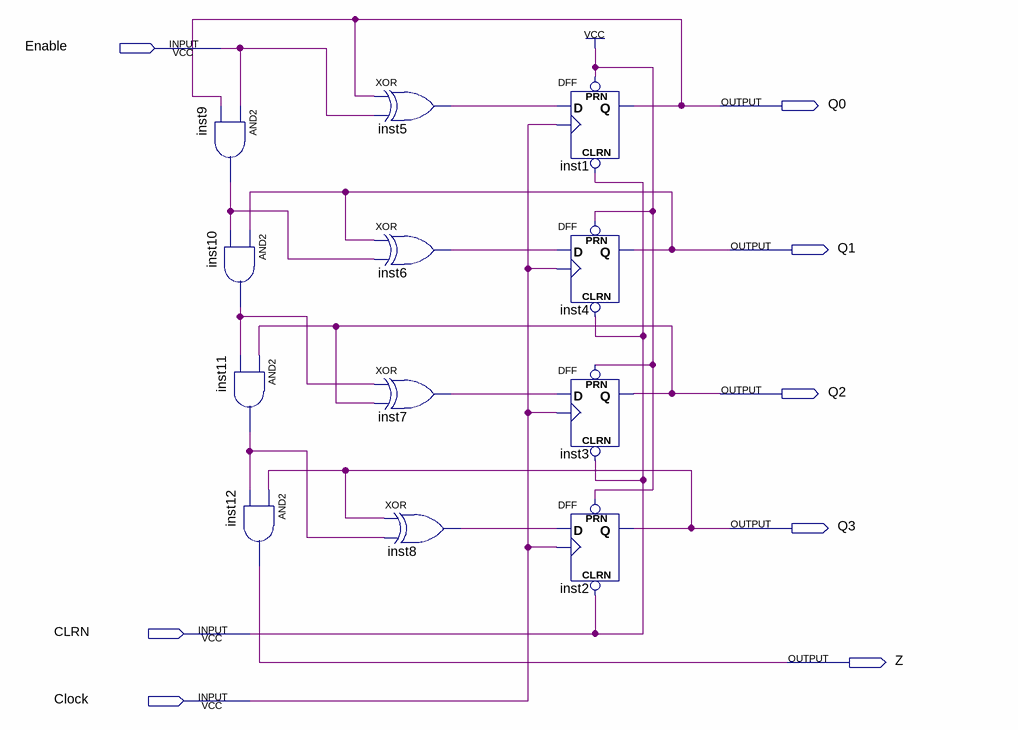
[diagram p0: schematic sheet]
// Quartus schematic lab10step2a.bdf as structural Verilog: 12 symbols, 8 pins
module lab10step2a (
  input  Enable,
  input  CLRN,
  input  Clock,
  output Q0,
  output Q1,
  output Q2,
  output Q3,
  output Z
);

  wire inst5_out, inst6_out, inst7_out, inst8_out, inst9_out, inst10_out, inst11_out;

  and inst9 (inst9_out, Enable, Q0);
  and inst10 (inst10_out, Q1, inst9_out);
  and inst11 (inst11_out, Q2, inst10_out);
  and inst12 (Z, Q3, inst11_out);
  xor inst5 (inst5_out, Q0, Enable);
  xor inst6 (inst6_out, Q1, inst9_out);
  xor inst7 (inst7_out, inst10_out, Q2);
  xor inst8 (inst8_out, Q3, inst11_out);
  DFF inst1 (.CLRN(CLRN), .CLK(Clock), .D(inst5_out), .PRN(1'b1), .Q(Q0));
  DFF inst4 (.CLRN(CLRN), .CLK(Clock), .D(inst6_out), .PRN(1'b1), .Q(Q1));
  DFF inst3 (.CLRN(CLRN), .CLK(Clock), .D(inst7_out), .PRN(1'b1), .Q(Q2));
  DFF inst2 (.CLRN(CLRN), .CLK(Clock), .D(inst8_out), .PRN(1'b1), .Q(Q3));
endmodule
